# EAGLE design MOTOR (EAGLE 9.4.2)
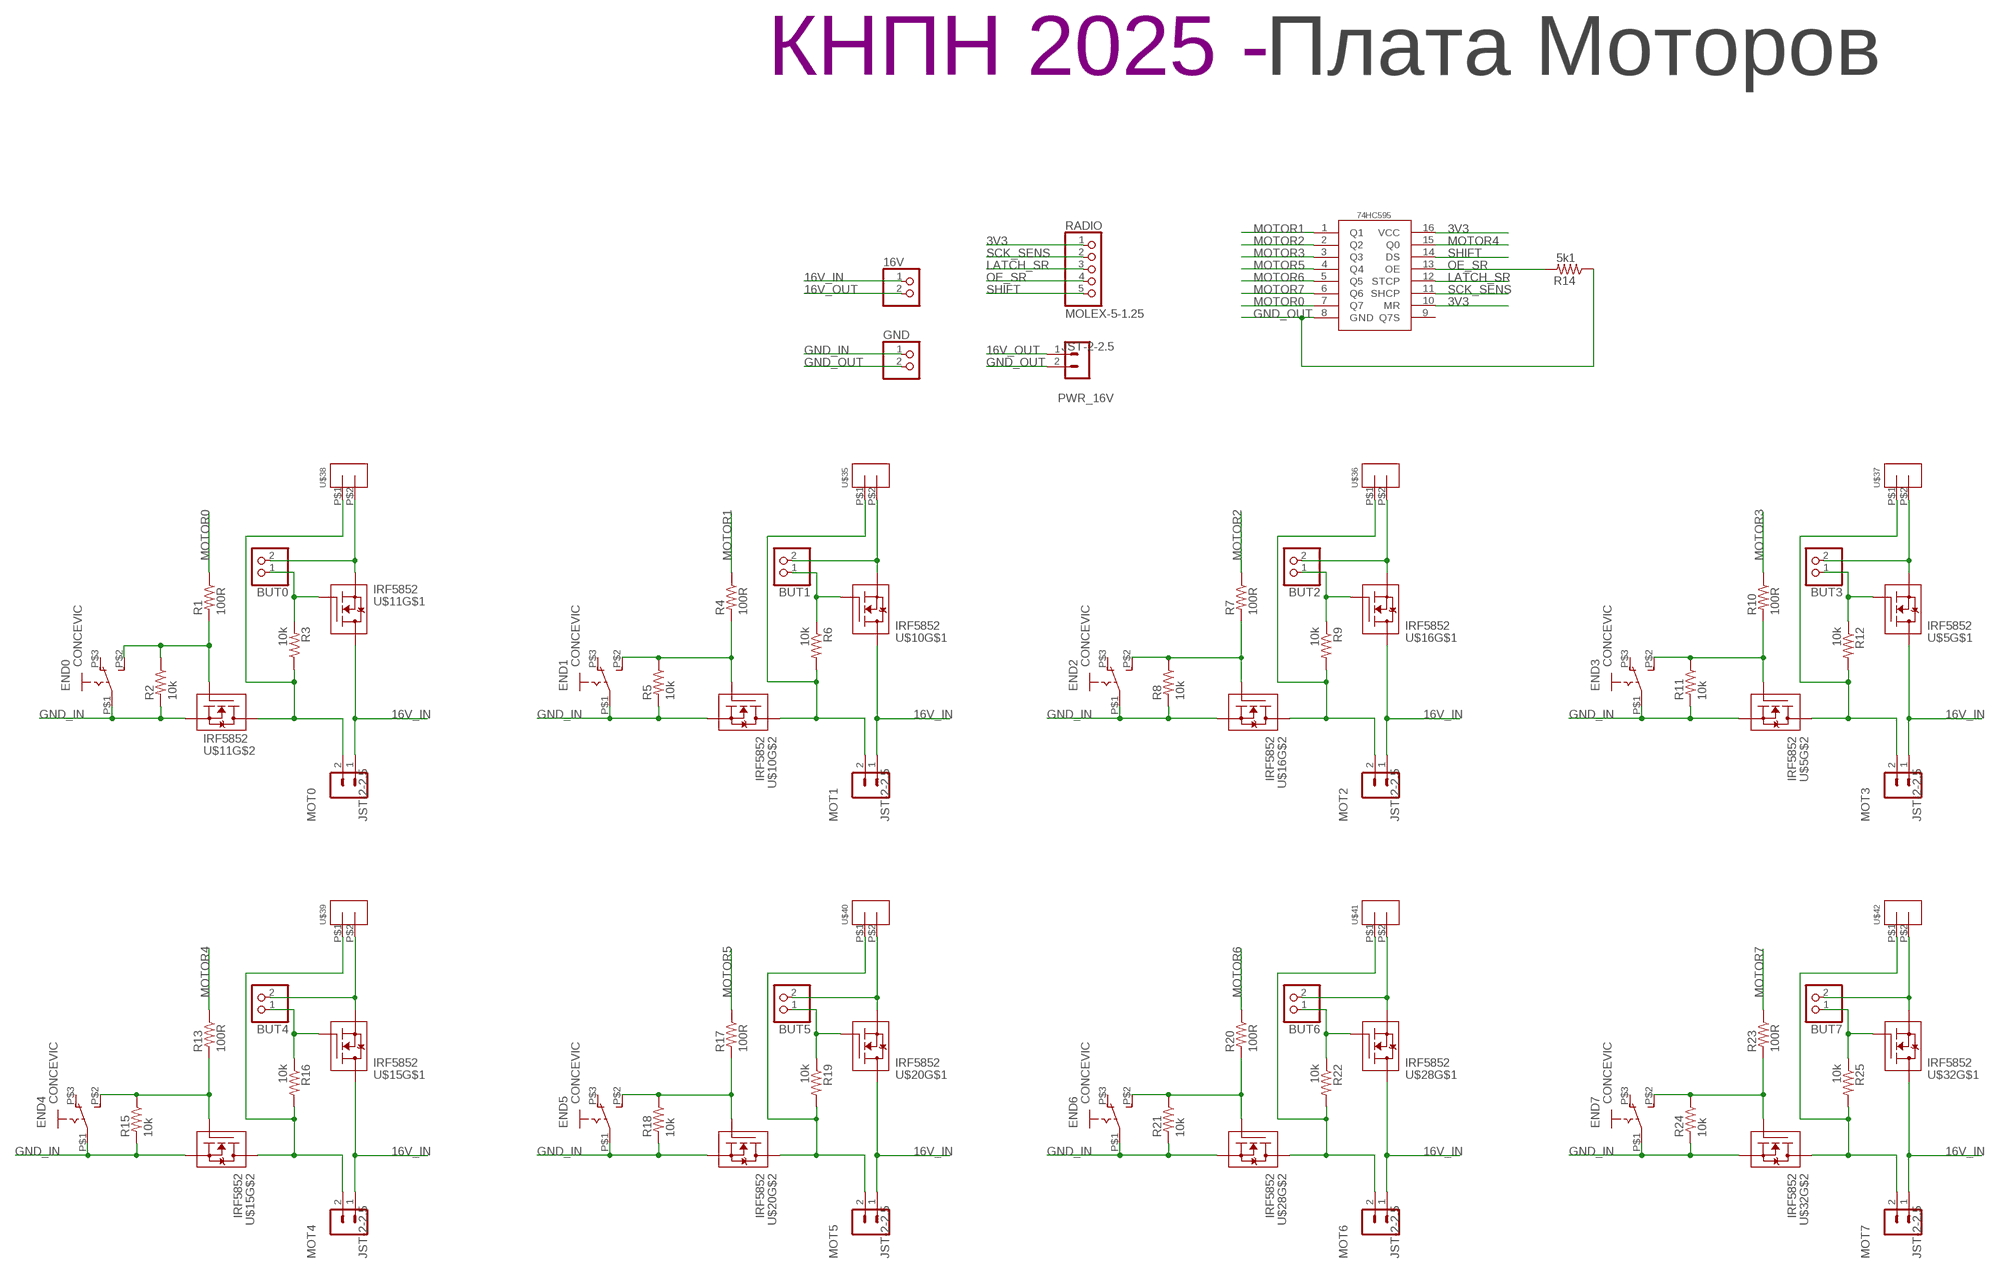
[diagram p0: schematic, sheet 1]

## Parts
16V  PINHD-1X2/90  [1X02/90]
74HC595  74HC595  [TSSOP16]
BUT0  PINHD-1X2  [1X02]
BUT1  PINHD-1X2  [1X02]
BUT2  PINHD-1X2  [1X02]
BUT3  PINHD-1X2  [1X02]
BUT4  PINHD-1X2  [1X02]
BUT5  PINHD-1X2  [1X02]
BUT6  PINHD-1X2  [1X02]
BUT7  PINHD-1X2  [1X02]
END0  CONCEVIC  [CONCEVIC]
END1  CONCEVIC  [CONCEVIC]
END2  CONCEVIC  [CONCEVIC]
END3  CONCEVIC  [CONCEVIC]
END4  CONCEVIC  [CONCEVIC]
END5  CONCEVIC  [CONCEVIC]
END6  CONCEVIC  [CONCEVIC]
END7  CONCEVIC  [CONCEVIC]
GND  PINHD-1X2/90  [1X02/90]
MOT0  JST-2-2.5  [JST-2-2.5]
MOT1  JST-2-2.5  [JST-2-2.5]
MOT2  JST-2-2.5  [JST-2-2.5]
MOT3  JST-2-2.5  [JST-2-2.5]
MOT4  JST-2-2.5  [JST-2-2.5]
MOT5  JST-2-2.5  [JST-2-2.5]
MOT6  JST-2-2.5  [JST-2-2.5]
MOT7  JST-2-2.5  [JST-2-2.5]
PWR_16V  JST-2-2.5  [JST-2-2.5]
R1  100R  R-US_R0603  [R0603]
R2  10k  R-US_R0603  [R0603]
R3  10k  R-US_R0603  [R0603]
R4  100R  R-US_R0603  [R0603]
R5  10k  R-US_R0603  [R0603]
R6  10k  R-US_R0603  [R0603]
R7  100R  R-US_R0603  [R0603]
R8  10k  R-US_R0603  [R0603]
R9  10k  R-US_R0603  [R0603]
R10  100R  R-US_R0603  [R0603]
R11  10k  R-US_R0603  [R0603]
R12  10k  R-US_R0603  [R0603]
R13  100R  R-US_R0603  [R0603]
R14  5k1  R-US_R0603  [R0603]
R15  10k  R-US_R0603  [R0603]
R16  10k  R-US_R0603  [R0603]
R17  100R  R-US_R0603  [R0603]
R18  10k  R-US_R0603  [R0603]
R19  10k  R-US_R0603  [R0603]
R20  100R  R-US_R0603  [R0603]
R21  10k  R-US_R0603  [R0603]
R22  10k  R-US_R0603  [R0603]
R23  100R  R-US_R0603  [R0603]
R24  10k  R-US_R0603  [R0603]
R25  10k  R-US_R0603  [R0603]
RADIO  MOLEX-5-1.25  [53047-05]
U$5  IRF5852  [TSOP-6]
U$9  Плата Моторов  LOGOPCB-""  [LOGO]
U$10  IRF5852  [TSOP-6]
U$11  IRF5852  [TSOP-6]
U$15  IRF5852  [TSOP-6]
U$16  IRF5852  [TSOP-6]
U$20  IRF5852  [TSOP-6]
U$28  IRF5852  [TSOP-6]
U$32  IRF5852  [TSOP-6]
U$35  CONTACT_SIDE_4MM_2PIN  [CONTACT_SIDE_4MM_2PIN]
U$36  CONTACT_SIDE_4MM_2PIN  [CONTACT_SIDE_4MM_2PIN]
U$37  CONTACT_SIDE_4MM_2PIN  [CONTACT_SIDE_4MM_2PIN]
U$38  CONTACT_SIDE_4MM_2PIN  [CONTACT_SIDE_4MM_2PIN]
U$39  CONTACT_SIDE_4MM_2PIN  [CONTACT_SIDE_4MM_2PIN]
U$40  CONTACT_SIDE_4MM_2PIN  [CONTACT_SIDE_4MM_2PIN]
U$41  CONTACT_SIDE_4MM_2PIN  [CONTACT_SIDE_4MM_2PIN]
U$42  CONTACT_SIDE_4MM_2PIN  [CONTACT_SIDE_4MM_2PIN]

## Nets
3V3: 74HC595.10(MR) 74HC595.16(VCC) RADIO.1
16V_IN: 16V.1 MOT0.1 MOT1.1 MOT2.1 MOT3.1 MOT4.1 MOT5.1 MOT6.1 MOT7.1 U$5.P$6(D1) U$10.P$6(D1) U$11.P$6(D1) U$15.P$6(D1) U$16.P$6(D1) U$20.P$6(D1) U$28.P$6(D1) U$32.P$6(D1)
16V_OUT: 16V.2 PWR_16V.1
GND_IN: END0.P$1(P) END1.P$1(P) END2.P$1(P) END3.P$1(P) END4.P$1(P) END5.P$1(P) END6.P$1(P) END7.P$1(P) GND.1 R2.2 R5.2 R8.2 R11.2 R15.2 R18.2 R21.2 R24.2 U$5.P$2(S1) U$10.P$2(S1) U$11.P$2(S1) U$15.P$2(S1) U$16.P$2(S1) U$20.P$2(S1) U$28.P$2(S1) U$32.P$2(S1)
GND_OUT: 74HC595.8(GND) GND.2 PWR_16V.2 R14.1
LATCH_SR: 74HC595.12(STCP) RADIO.3
MOTOR0: 74HC595.7(Q7) R1.1
MOTOR1: 74HC595.1(Q1) R4.1
MOTOR2: 74HC595.2(Q2) R7.1
MOTOR3: 74HC595.3(Q3) R10.1
MOTOR4: 74HC595.15(Q0) R13.1
MOTOR5: 74HC595.4(Q4) R17.1
MOTOR6: 74HC595.5(Q5) R20.1
MOTOR7: 74HC595.6(Q6) R23.1
N$1: MOT0.2 R3.1 U$11.P$4(D1) U$38.P$1
N$2: MOT1.2 R6.2 U$10.P$4(D1) U$35.P$1
N$3: END1.P$2(S) R4.2 R5.1 U$10.P$3(G1)
N$4: END0.P$2(S) R1.2 R2.1 U$11.P$3(G1)
N$5: BUT1.2 U$10.P$5(S1) U$35.P$2
N$6: BUT0.1 R3.2 U$11.P$1(G1)
N$7: BUT1.1 R6.1 U$10.P$1(G1)
N$8: BUT0.2 U$11.P$5(S1) U$38.P$2
N$9: MOT2.2 R9.2 U$16.P$4(D1) U$36.P$1
N$10: BUT2.2 U$16.P$5(S1) U$36.P$2
N$11: END3.P$2(S) R10.2 R11.1 U$5.P$3(G1)
N$12: END2.P$2(S) R7.2 R8.1 U$16.P$3(G1)
N$13: BUT2.1 R9.1 U$16.P$1(G1)
N$14: MOT3.2 R12.2 U$5.P$4(D1) U$37.P$1
N$15: BUT3.2 U$5.P$5(S1) U$37.P$2
N$16: BUT3.1 R12.1 U$5.P$1(G1)
N$17: END4.P$2(S) R13.2 R15.1 U$15.P$3(G1)
N$18: MOT4.2 R16.2 U$15.P$4(D1) U$39.P$1
N$19: BUT4.2 U$15.P$5(S1) U$39.P$2
N$20: BUT4.1 R16.1 U$15.P$1(G1)
N$21: END5.P$2(S) R17.2 R18.1 U$20.P$3(G1)
N$22: MOT5.2 R19.2 U$20.P$4(D1) U$40.P$1
N$23: BUT5.2 U$20.P$5(S1) U$40.P$2
N$24: BUT5.1 R19.1 U$20.P$1(G1)
N$25: END6.P$2(S) R20.2 R21.1 U$28.P$3(G1)
N$26: MOT6.2 R22.2 U$28.P$4(D1) U$41.P$1
N$27: BUT6.2 U$28.P$5(S1) U$41.P$2
N$28: BUT6.1 R22.1 U$28.P$1(G1)
N$29: END7.P$2(S) R23.2 R24.1 U$32.P$3(G1)
N$30: MOT7.2 R25.2 U$32.P$4(D1) U$42.P$1
N$31: BUT7.2 U$32.P$5(S1) U$42.P$2
N$32: BUT7.1 R25.1 U$32.P$1(G1)
OE_SR: 74HC595.13(OE) R14.2 RADIO.4
SCK_SENS: 74HC595.11(SHCP) RADIO.2
SHIFT: 74HC595.14(DS) RADIO.5
Unconnected: 74HC595.9(Q7S) END0.P$3(O) END1.P$3(O) END2.P$3(O) END3.P$3(O) END4.P$3(O) END5.P$3(O) END6.P$3(O) END7.P$3(O)

## Library data of the parts
16V GND = pinhead:PINHD-1X2: PIN HEADER
74HC595 = CanCubeSat:74HC595
BUT0 BUT1-BUT7 = pinheadCS:PINHD-1X2: PIN HEADER
END0 END1-END7 = CanCubeSat:CONCEVIC
MOT0 MOT1-MOT7 PWR_16V = UNKNOWN-2024:JST-2-2.5: JST PH series header 2.00mm pitch disconnectable crimp style connectors, vertical (side entry type), 2 pins
R1-R25 = rcl:R-US_: RESISTOR, American symbol; SPICEPREFIX: R
RADIO = UNKNOWN-2024:MOLEX-5-1.25
U$5 U$10 U$11 U$15 U$16 U$20 U$28 U$32 = NA-2025:IRF5852
U$9 = UNKNOWN-2024:LOGO
U$35-U$42 = UNKNOWN-2024:CONTACT_SIDE_4MM_2PIN

## Board
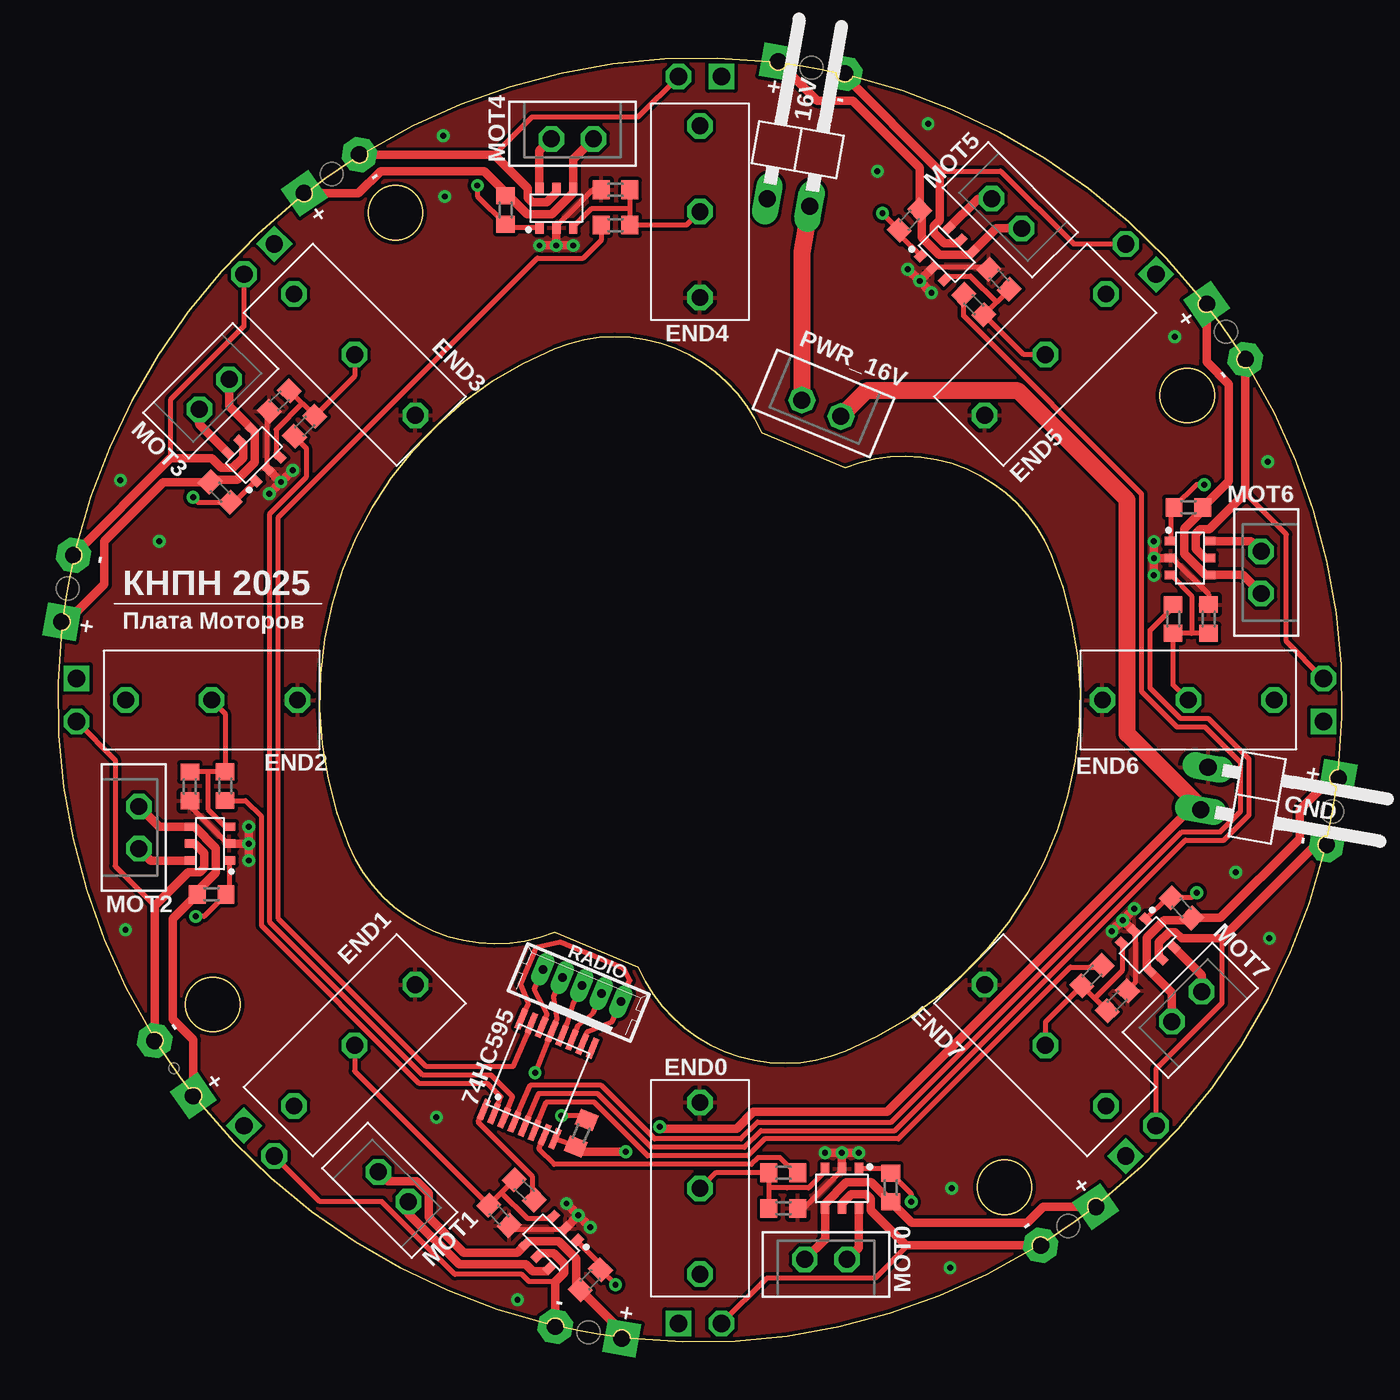
[diagram p1: board, top side]
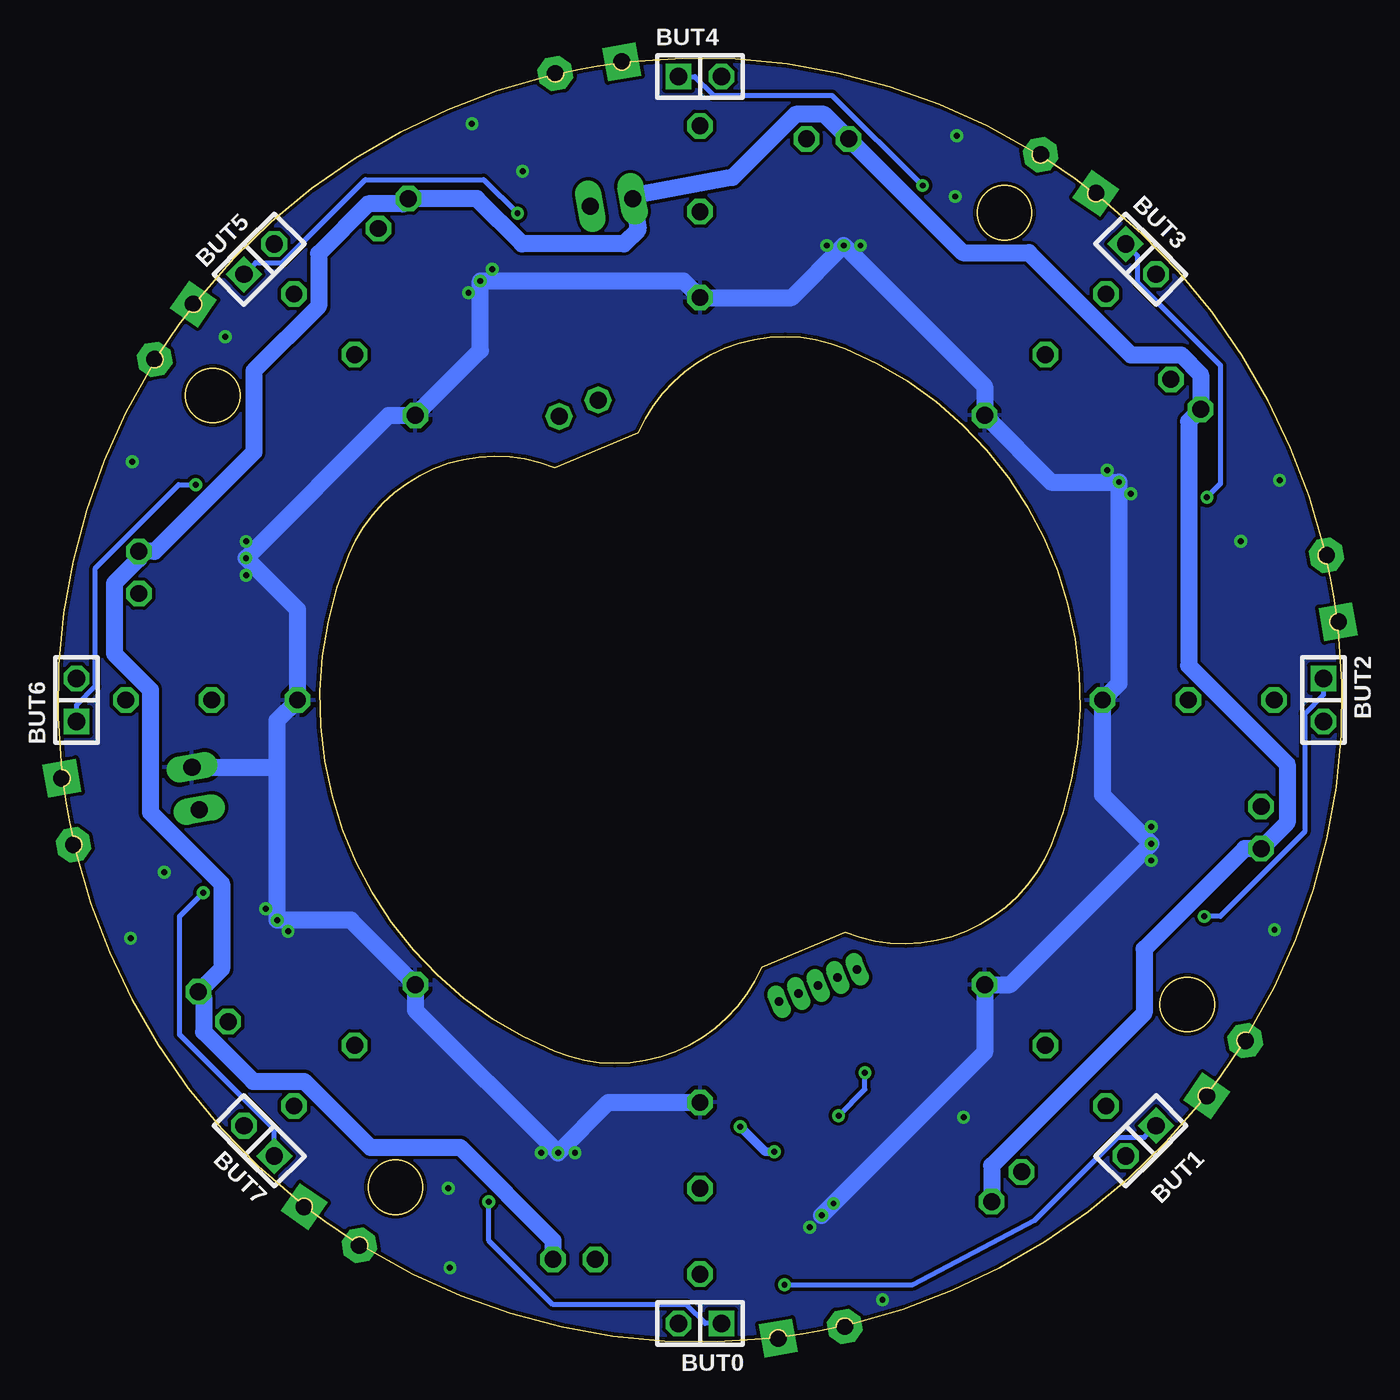
[diagram p2: board, bottom side, seen from below]

Size 75.97 x 75.97 mm. Coordinates in mm from the lower left corner, seen from the top.
Outline: 33.86,0.21 arc167 32.87,0.33 arc-5 29.91,0.85 arc167 28.95,1.08 arc-37 8.36,14.19 arc167 7.74,14.98 arc-5 6.02,17.44 arc167 5.5,18.28 arc-37 0.21,42.12 arc167 0.33,43.1 arc-5 0.85,46.06 arc167 1.08,47.03 arc-37 14.19,67.62 arc167 14.98,68.23 arc-5 17.44,69.95 arc167 18.28,70.48 arc-37 42.12,75.76 arc167 43.1,75.64 arc-5 46.06,75.12 arc167 47.03,74.9 arc-37 67.62,61.78 arc167 68.23,60.99 arc-5 69.95,58.54 arc167 70.48,57.69 arc-37 75.76,33.86 arc167 75.64,32.87 arc-5 75.12,29.91 arc167 74.9,28.95 arc-37 61.78,8.36 arc167 60.99,7.74 arc-5 58.54,6.02 arc167 57.69,5.5 arc-37 33.86,0.21
Outline: 34.34,22.18 29.39,24.23 arc-89 17.2,29.38 arc-90 29.38,58.77 arc-89 41.63,53.79 46.59,51.74 arc-89 58.77,46.6 arc-90 46.6,17.2 arc-89 34.34,22.18
Outline: circle at 9.15,19.97 radius 1.6
Outline: circle at 19.97,66.82 radius 1.6
Outline: circle at 56,9.15 radius 1.6
Outline: circle at 66.82,56 radius 1.6
Copper layers (1*16): Top 0.035mm / dielectric 1.5mm / Bottom 0.035mm
Design rules "default *": minimum track width 0.3mm, minimum drill 0.35mm, track to track 0.2mm, track to pad 0.2mm, pad to pad 0.2mm, via to via 0.2mm, smd to smd 0.2mm, copper to edge 0.2mm, drill to drill 6mil, minimum pad ring 10mil, minimum via ring 8mil, stop-mask expansion 4mil, vias tented up to drill 0mil, thermal gap 10mil

### Footprints (pad centres in the part's own frame; a part is rotated, then mirrored left to right if it is on the bottom)
1X02/90 = drill 1.016 long: 1 -1.27,-3.81; 2 1.27,-3.81
TSSOP16 = smd 1.26 x 0.36: 1 -2.9,2.275; 2 -2.9,1.625; 3 -2.9,0.975; 4 -2.9,0.325; 5 -2.9,-0.325; 6 -2.9,-0.975; 7 -2.9,-1.625; 8 -2.9,-2.275; 9 2.9,-2.275; 10 2.9,-1.625; 11 2.9,-0.975; 12 2.9,-0.325; 13 2.9,0.325; 14 2.9,0.975; 15 2.9,1.625; 16 2.9,2.275
1X02 = drill 1.016 square: 1 -1.27,0 | drill 1.016 octagon: 2 1.27,0
CONCEVIC = drill 1 octagon: P$1 0,5.08; P$2 0,0; P$3 0,-5.08
JST-2-2.5 = drill 1 pad 1.5 octagon: 1 1.25,0; 2 -1.25,0
R0603 = smd 1 x 1.1: 1 -0.85,0; 2 0.85,0
53047-05 = drill 0.5 pad 0.698 long: 1 2.5,0.45; 2 1.25,0.45; 3 0,0.45; 4 -1.25,0.45; 5 -2.5,0.45
TSOP-6 = smd 0.5 x 0.7: P$1 -1,-1.15; P$2 0,-1.15; P$3 1,-1.15; P$4 1,1.15; P$5 0,1.15; P$6 -1,1.15
CONTACT_SIDE_4MM_2PIN = drill 1 pad 2 square: P$1 -2,0 | drill 1 pad 2 octagon: P$2 2,0

### Placement (x,y rotation side)
16V  43.89,71.19 350 top
74HC595  28.41,15.57 67.5 top
BUT0  37.99,1.09 180 bottom
BUT1  11.89,11.89 225 bottom
BUT2  1.09,37.99 270 bottom
BUT3  11.89,64.08 315 bottom
BUT4  37.99,74.89 0 bottom
BUT5  64.08,64.08 45 bottom
BUT6  74.89,37.99 90 bottom
BUT7  64.08,11.89 135 bottom
END0  37.99,9.09 0 top
END1  17.55,17.55 315 top
END2  9.09,37.99 270 top
END3  17.55,58.42 225 top
END4  37.99,66.89 180 top
END5  58.42,58.42 135 top
END6  66.89,37.99 90 top
END7  58.42,17.55 45 top
GND  71.59,32.09 260 top
MOT0  45.44,4.88 0 top
MOT1  19.84,9.18 315 top
MOT2  4.78,30.44 270 top
MOT3  9.24,56.08 225 top
MOT4  30.44,71.2 180 top
MOT5  56.14,66.78 135 top
MOT6  71.2,45.54 90 top
MOT7  66.8,19.84 45 top
PWR_16V  45.17,55.25 157.5 top
R1  42.92,10.01 180 top
R2  42.92,7.9 0 top
R3  49.28,9.14 90 top
R4  27.59,8.99 135 top
R5  26.09,7.49 315 top
R6  31.5,3.68 225 top
R7  9.89,32.89 90 top
R8  7.8,32.88 270 top
R9  9.09,26.49 180 top
R10  14.59,54.19 45 top
R11  13.09,55.69 225 top
R12  9.59,50.29 135 top
R13  32.99,66.09 0 top
R14  30.96,12.35 67.5 top
R15  32.99,68.19 180 top
R16  26.49,66.99 90 top
R17  54.19,61.39 315 top
R18  55.69,62.89 135 top
R19  50.39,66.39 45 top
R20  65.99,42.79 270 top
R21  68.09,42.79 90 top
R22  66.89,49.39 0 top
R23  61.19,21.69 225 top
R24  62.69,20.19 45 top
R25  66.49,25.69 315 top
RADIO  30.82,20.67 337.5 top
U$5  11.59,52.49 45 top
U$9  3.31,43.68 0 top
U$10  29.19,5.89 135 top
U$11  46.39,9.09 180 top
U$15  29.49,67.09 0 top
U$16  8.99,29.49 90 top
U$20  52.59,64.39 315 top
U$28  66.99,46.39 270 top
U$32  64.49,23.49 225 top
U$35  31.39,0.56 170 top
U$36  6.86,16.19 125 top
U$37  0.56,44.59 80 top
U$38  59.78,6.86 215 top
U$39  16.19,69.11 35 top
U$40  44.59,75.41 350 top
U$41  69.11,59.78 305 top
U$42  75.41,31.39 260 top

### Tracks (layer width: path | path; a pad name or v marks a point on that pad's centre or on a via)
3V3
  Top 0.3: 74HC595.10 31.33,18.36 32.79,18.94 RADIO.1 33.84,21.4 33.49,22.09 33.36,22.15 29.71,23.66 28.26,23.31 27.34,21.17 27.81,20.04 74HC595.16
16V_IN
  Top 0.5: MOT0.1 47.39,5.58 U$11.P$6 | MOT7.1 67.68,21.71 U$32.P$6 | MOT6.1 70.6,47.39 U$28.P$6 | U$20.P$6 54.45,67.66 MOT5.1 | MOT4.1 28.49,70.5 U$15.P$6 | MOT3.1 8.35,54.31 U$5.P$6 | MOT2.1 5.48,28.49 U$16.P$6 | MOT1.1 20.72,7.59 23.73,4.59 27.69,4.59 28.09,4.19 28.9,4.19 U$10.P$6
  Bottom 1: MOT1.1 20.72,10.43 11.7,19.45 11.7,23.24 5.75,29.19 MOT2.1 3.23,30.73 3.23,34.19 9.06,40.02 9.06,54.48 MOT3.1 8.35,57.25 9.52,58.41 12.48,58.41 18.53,64.46 22.42,64.46 29.17,71.21 MOT4.1 30.64,72.65 32.33,72.65 36.06,68.92 41.77,67.86 16V.1 41.65,65.83 42.49,64.99 48.51,64.99 51.19,67.66 MOT5.1 55.57,67.35 57.62,67.35 60.56,64.41 60.56,61.3 64.39,57.47 64.39,52.65 70.26,46.79 MOT6.1 71.2,46.34 72.65,44.89 72.65,40.73 70.51,38.59 70.51,31.33 66.3,27.12 66.3,22.08 67.66,20.72 MOT7.1 67.37,20.41 67.37,18.35 64.43,15.41 61.41,15.41 57.5,11.5 52.18,11.5 46.69,6.01 MOT0.1
16V_OUT
  Top 1: PWR_16V.1 44.02,64.49 16V.2
GND_IN  (via drill 0.35)
  Top 0.3: R2.2 44.14,7.9 46.39,10.14 U$11.P$2 | U$32.P$2 63.74,24.23 63.74,21.24 R24.2 | R18.2 54.93,63.64 51.84,63.64 U$20.P$2 | R15.2 31.64,68.19 29.49,66.03 U$15.P$2 | R11.2 12.33,54.93 12.33,51.74 U$5.P$2 | U$16.P$2 10.04,29.49 7.8,31.73 R8.2 | R5.2 26.94,6.63 29.93,6.63 U$10.P$2 | R21.2 68.09,44.23 65.93,46.39 U$28.P$2
  Top 0.5: U$11.P$2 v46.39,11.19 | v46.39,11.19 v47.39,11.19 | v46.39,11.19 v45.39,11.19 | U$32.P$2 v63.01,24.96 | v63.01,24.96 v63.69,25.64 | v63.01,24.96 v62.37,24.32 v62.37,24.31 | U$28.P$2 v64.85,46.38 | v64.85,46.38 v64.85,47.37 | v64.85,46.38 v64.85,45.38 | U$20.P$2 v50.99,62.79 | v50.99,62.79 v50.29,63.49 | v50.99,62.79 v51.69,62.09 | U$15.P$2 v29.49,64.89 | v29.49,64.89 v30.49,64.89 | v29.49,64.89 v28.49,64.89 | U$5.P$2 v13.19,50.89 | v13.19,50.89 | v13.19,50.89 v12.49,50.19 | v13.19,50.89 v13.89,51.59 | U$16.P$2 v11.29,29.49 | v11.29,29.49 v11.29,30.49 | v11.29,29.49 v11.29,28.49 | U$10.P$2 v30.79,7.49 | v30.79,7.49 v30.09,8.19 | v30.79,7.49 v31.49,6.79
  Bottom 1: END0.P$1 43.41,14.17 v46.39,11.19 54.83,19.63 END7.P$1 58.65,24.96 v63.01,24.96 63.01,34.01 | 63.01,34.01 63.01,36.78 END6.P$1 61.81,43.34 v64.85,46.38 56.41,54.83 END5.P$1 50.99,58.67 v50.99,62.79 38.97,62.79 END4.P$1 32.57,61.81 v29.49,64.89 21.14,56.54 END3.P$1 17.2,50.89 v13.19,50.89 13.19,38.97 END2.P$1 14.17,32.37 v11.29,29.49 19.63,21.14 END1.P$1 21.14,17.13 v30.79,7.49 | GND.1 63.02,34 63.01,34.01
  other vias: 66.09,59.49 71.59,52.09 69.69,27.79 71.69,23.89 52.89,9.09 52.79,4.39 27.19,2.49 22.39,13.29 3.99,24.39 5.99,47.39 3.69,50.99 22.89,67.79 22.79,71.39 48.49,69.29 51.49,72.09
  pour Top: 37.99,75.99 53.99,75.99 75.99,53.99 75.99,21.99 53.99,-0.01 21.99,-0.01 -0.01,21.99 -0.01,53.99 21.99,75.99
  pour Bottom: 21.99,75.99 53.99,75.99 75.99,53.99 75.99,21.99 53.99,-0.01 21.99,-0.01 -0.01,21.99 -0.01,53.99
GND_OUT  (via drill 0.35)
  Top 0.3: R14.1 74HC595.8
  Top 0.5: GND.2 67.6,31.49 66.95,31.49 49.07,13.61 41.15,13.61 40.15,12.61 35.74,12.61 v35.61,12.73 | v33.59,11.25 30.94,11.25 R14.1
  Top 1: GND.2 67.61,31.64 63.27,35.98 63.27,49.83 56.81,56.28 47.84,56.28 PWR_16V.2
  Bottom 0.5: v35.61,12.73 34.13,11.25 v33.59,11.25
LATCH_SR
  Top 0.3: 74HC595.12 30.15,18.92 30.47,19.97 RADIO.3
MOTOR0
  Top 0.3: R1.1 43.61,10.01 42.71,10.91 41.42,10.91 41.02,10.51 29.35,10.51 28.44,11.41 74HC595.7
MOTOR1
  Top 0.3: R4.1 28.08,8.5 28.08,9.77 24.86,12.98 74HC595.1
MOTOR2
  Top 0.3: 74HC595.2 26.2,14.51 25.42,15.29 21.38,15.29 12.04,24.63 12.04,31.08 11.08,32.04 R7.1
MOTOR3
  Top 0.3: 74HC595.3 26.9,14.52 25.63,15.79 21.58,15.79 12.54,24.83 12.54,49.02 14.68,51.16 14.68,52.89 R10.1
MOTOR4
  Top 0.3: 74HC595.15 26.92,16.29 21.79,16.29 13.04,25.04 13.04,48.81 28.36,64.14 31.08,64.14 32.14,65.19 R13.1
MOTOR5
  Top 0.3: 74HC595.4 27.93,15.18 32.13,15.18 35.31,12.01 40.4,12.01 41.4,13.01 49.32,13.01 66.5,30.19 68.78,30.19 69.99,31.39 69.99,34.28 67.88,36.38 66.22,36.38 64.12,38.48 64.12,50.18 53.59,60.71 R17.1
MOTOR6
  Top 0.3: 74HC595.5 28.43,14.68 31.92,14.68 35.1,11.51 40.61,11.51 41.61,12.51 49.53,12.51 66.71,29.69 68.99,29.69 70.49,31.19 70.49,34.49 68.09,36.88 66.43,36.88 64.62,38.69 64.62,42.12 65.99,43.48 R20.1
MOTOR7
  Top 0.3: 74HC595.6 28.89,14.18 31.72,14.18 34.89,11.01 40.81,11.01 41.81,12.01 49.73,12.01 59.91,22.18 61.68,22.18 R23.1
N$1
  Top 0.5: MOT0.2 45.39,6.08 U$11.P$4 45.39,8.17 46.65,9.44 48.11,9.44 49.26,8.29 R3.1 50.51,7.05 57.35,7.05 58.31,8.01 U$38.P$1
N$2
  Top 0.5: U$35.P$1 33.36,0.61 R6.2 30.65,3.32 30.65,4.91 29.62,5.95 27.83,5.95 U$10.P$4 27.17,5.29 24.02,5.29 21.92,7.38 21.92,8.79 21.22,9.5 19.52,9.5 MOT1.2
N$3
  Top 0.3: 26.24,8.84 R5.1 17.55,16.02 END1.P$2 | 26.24,8.84 R4.2 | 26.24,8.84 27.78,7.29 29.18,7.29 U$10.P$3
N$4
  Top 0.3: 42.07,9.09 R1.2 38.91,10.01 END0.P$2 | 42.07,9.09 R2.1 | U$11.P$3 45.39,10.08 44.41,9.11 43.12,9.11 42.09,9.11 42.07,9.09
N$5
  Top 0.3: BUT1.2 15.49,8.3 19.16,8.3 22.63,4.83 22.64,4.83 23.48,3.99 27.44,3.99 27.87,3.56 29.43,3.56
  Top 0.5: U$10.P$5 28.54,5.24 29.34,5.24 29.95,4.62 29.95,4.08 29.43,3.56 29.42,3.55 U$35.P$2
N$6  (via drill 0.35)
  Top 0.3: U$11.P$1 49.03,10.24 R3.2 50.49,8.78 v50.49,8.29
  Bottom 0.3: BUT0.1 37.68,1.09 38.8,2.2 46.7,2.2 50.49,5.99 v50.49,8.29
N$7  (via drill 0.35)
  Top 0.3: U$10.P$1 32.1,4.6 R6.1 v32.99,3.39
  Bottom 0.3: BUT1.1 11.68,12.11 13.25,12.11 18.17,7.19 25.38,3.39 v32.99,3.39
N$8
  Top 0.3: BUT0.2 41.94,3.77 48.34,3.77 50.28,5.71
  Top 0.5: U$11.P$5 46.39,8.17 46.95,8.74 47.82,8.74 48.09,8.47 48.09,7.79 50.17,5.71 50.28,5.71 U$38.P$2
N$9
  Top 0.5: MOT2.2 5.98,30.49 U$16.P$4 8.07,30.49 9.34,29.22 9.34,27.76 8.24,26.66 R9.2 6.79,25.04 6.79,19.09 8.01,17.87 U$36.P$1
N$10
  Top 0.3: BUT2.2 3.37,34.43 3.37,28.15 5.71,25.81
  Top 0.5: U$36.P$2 5.71,25.81 7.69,27.79 8.37,27.79 8.64,28.05 8.64,28.92 8.07,29.49 U$16.P$5
N$11
  Top 0.3: R11.1 14.44,55.54 | 14.44,55.54 R10.2 17.55,57.15 END3.P$2 | 14.44,55.54 12.89,53.99 12.89,52.59 U$5.P$3
N$12
  Top 0.3: 8.89,33.73 R7.2 9.89,37.19 END2.P$2 | 8.89,33.73 R8.1 | 8.89,33.73 8.89,31.49 9.89,30.49 U$16.P$3
N$13  (via drill 0.35)
  Top 0.3: U$16.P$1 10.14,26.69 R9.1 8.64,25.18 v8.14,25.18
  Bottom 0.3: BUT2.1 1.09,38.29 2.2,37.18 2.2,30.17 7.2,25.18 v8.14,25.18
N$14
  Top 0.5: MOT3.2 10.12,55.37 U$5.P$4 11.65,53.84 11.65,52.05 10.61,51.02 9.12,51.02 R12.2 6.23,50.89 2.74,47.39 2.74,44.84 0.52,42.62 U$37.P$1
N$15
  Top 0.3: 6.64,52.29 6.65,52.29 6.65,55.75 11,60.1 BUT3.2
  Top 0.5: U$37.P$2 6.64,52.29 9.08,52.29 9.65,51.72 10.32,51.72 10.94,52.34 10.94,53.13 U$5.P$5
N$16  (via drill 0.35)
  Top 0.3: U$5.P$1 10.41,49.69 R12.1 8.29,49.69 v7.99,49.99
  Bottom 0.3: BUT3.1 12.11,64.29 12.11,62.72 7.19,57.8 7.19,50.79 v7.99,49.99
N$17
  Top 0.3: R15.1 33.84,67.09 | 33.84,67.09 R13.2 37.19,66.09 END4.P$2 | 33.84,67.09 31.59,67.09 30.49,65.98 U$15.P$3
N$18
  Top 0.5: MOT4.2 30.49,70 U$15.P$4 30.49,68 29.22,66.74 27.76,66.74 26.66,67.84 | 26.66,67.84 R16.2 | U$39.P$1 17.77,67.97 19.09,69.29 25.21,69.29 26.66,67.84
N$19
  Top 0.3: BUT4.2 34.32,72.49 28.04,72.49 25.81,70.26
  Top 0.5: U$39.P$2 25.81,70.26 27.79,68.29 27.79,67.7 28.05,67.44 28.92,67.44 29.49,68 U$15.P$5
N$20  (via drill 0.35)
  Top 0.3: U$15.P$1 26.69,65.94 R16.1 24.81,67.81 v24.81,68.44
  Bottom 0.3: BUT4.1 38.29,74.89 37.18,73.77 30.17,73.77 24.84,68.44 v24.81,68.44
N$21
  Top 0.3: END5.P$2 57.15,58.42 R17.2 55.54,61.54 | R18.1 55.54,61.54 | 55.54,61.54 53.99,63.08 52.69,63.08 U$20.P$3
N$22
  Top 0.5: MOT5.2 55.51,65.89 U$20.P$4 53.94,64.33 52.15,64.33 51.12,65.36 51.12,67.15 50.99,67.28 | 50.99,67.28 50.99,69.48 47.02,73.46 44.92,73.46 U$40.P$1 | 50.99,67.28 R19.2
N$23
  Top 0.3: 52.18,69.29 55.78,69.29 60.1,64.98 BUT5.2
  Top 0.5: U$40.P$2 46.55,74.92 52.18,69.29 52.18,66.38 51.82,66.02 51.82,65.65 52.44,65.03 53.23,65.03 U$20.P$5
N$24  (via drill 0.35)
  Top 0.3: U$20.P$1 49.79,65.56 R19.1 v48.79,66.79
  Bottom 0.3: BUT5.1 64.29,63.86 62.72,63.86 57.8,68.79 50.79,68.79 v48.79,66.79
N$25
  Top 0.3: R21.1 67.09,41.94 | 67.09,41.94 R20.2 65.99,38.89 END6.P$2 | U$28.P$3 67.09,44.14 67.09,41.94
N$26
  Top 0.5: MOT6.2 70.1,45.39 U$28.P$4 67.9,45.39 66.64,46.65 66.64,48.11 67.74,49.21 R22.2 69.29,50.94 69.29,56.69 67.97,58.01 U$41.P$1
N$27
  Top 0.3: BUT6.2 72.69,41.46 72.69,47.79 70.25,50.22
  Top 0.5: U$28.P$5 67.9,46.39 67.34,46.95 67.34,47.82 67.6,48.09 68.12,48.09 70.25,50.22 70.26,50.23 U$41.P$2
N$28  (via drill 0.35)
  Top 0.3: U$28.P$1 65.84,49.19 R22.1 67.38,50.73 v67.84,50.73
  Bottom 0.3: BUT6.1 74.89,37.68 73.77,38.8 73.77,45.8 68.84,50.73 v67.84,50.73
N$29
  Top 0.3: 61.34,20.34 R23.2 58.42,18.92 END7.P$2 | 61.34,20.34 R24.1 | U$32.P$3 62.97,21.97 61.34,20.34
N$30
  Top 0.5: MOT7.2 65.91,20.65 U$32.P$4 64.43,22.13 64.43,23.92 65.46,24.95 66.96,24.95 R25.2 68.79,25.09 73.49,29.78 73.49,31.49 75.36,33.36 U$42.P$1
N$31
  Top 0.3: BUT7.2 64.98,16.16 68.89,20.07 68.89,23.89
  Top 0.5: U$42.P$2 74.42,29.42 68.89,23.89 66.48,23.89 66.12,24.25 65.75,24.25 65.13,23.64 65.13,22.84 U$32.P$5
N$32  (via drill 0.35)
  Top 0.3: U$32.P$1 65.66,26.29 R25.1 67.09,26.29 v67.39,26.59
  Bottom 0.3: BUT7.1 63.18,12.57 68.79,18.18 68.79,25.19 v67.39,26.59
OE_SR  (via drill 0.35)
  Top 0.3: RADIO.4 29.32,20.42 29.53,19.12 74HC595.13 29.18,18.33 v28.23,15.93 | R14.2 31.03,13.39 v29.79,13.39
  Bottom 0.3: v29.79,13.39 28.23,14.95 v28.23,15.93
SCK_SENS
  Top 0.3: 74HC595.11 30.77,18.73 31.66,19.46 RADIO.2
SHIFT
  Top 0.3: 74HC595.14 28.94,19.38 28.19,20.83 RADIO.5

### Text on the board
tNames: PWR_16V